# EAGLE design Arduino Sersor Board (EAGLE 7.5.0)
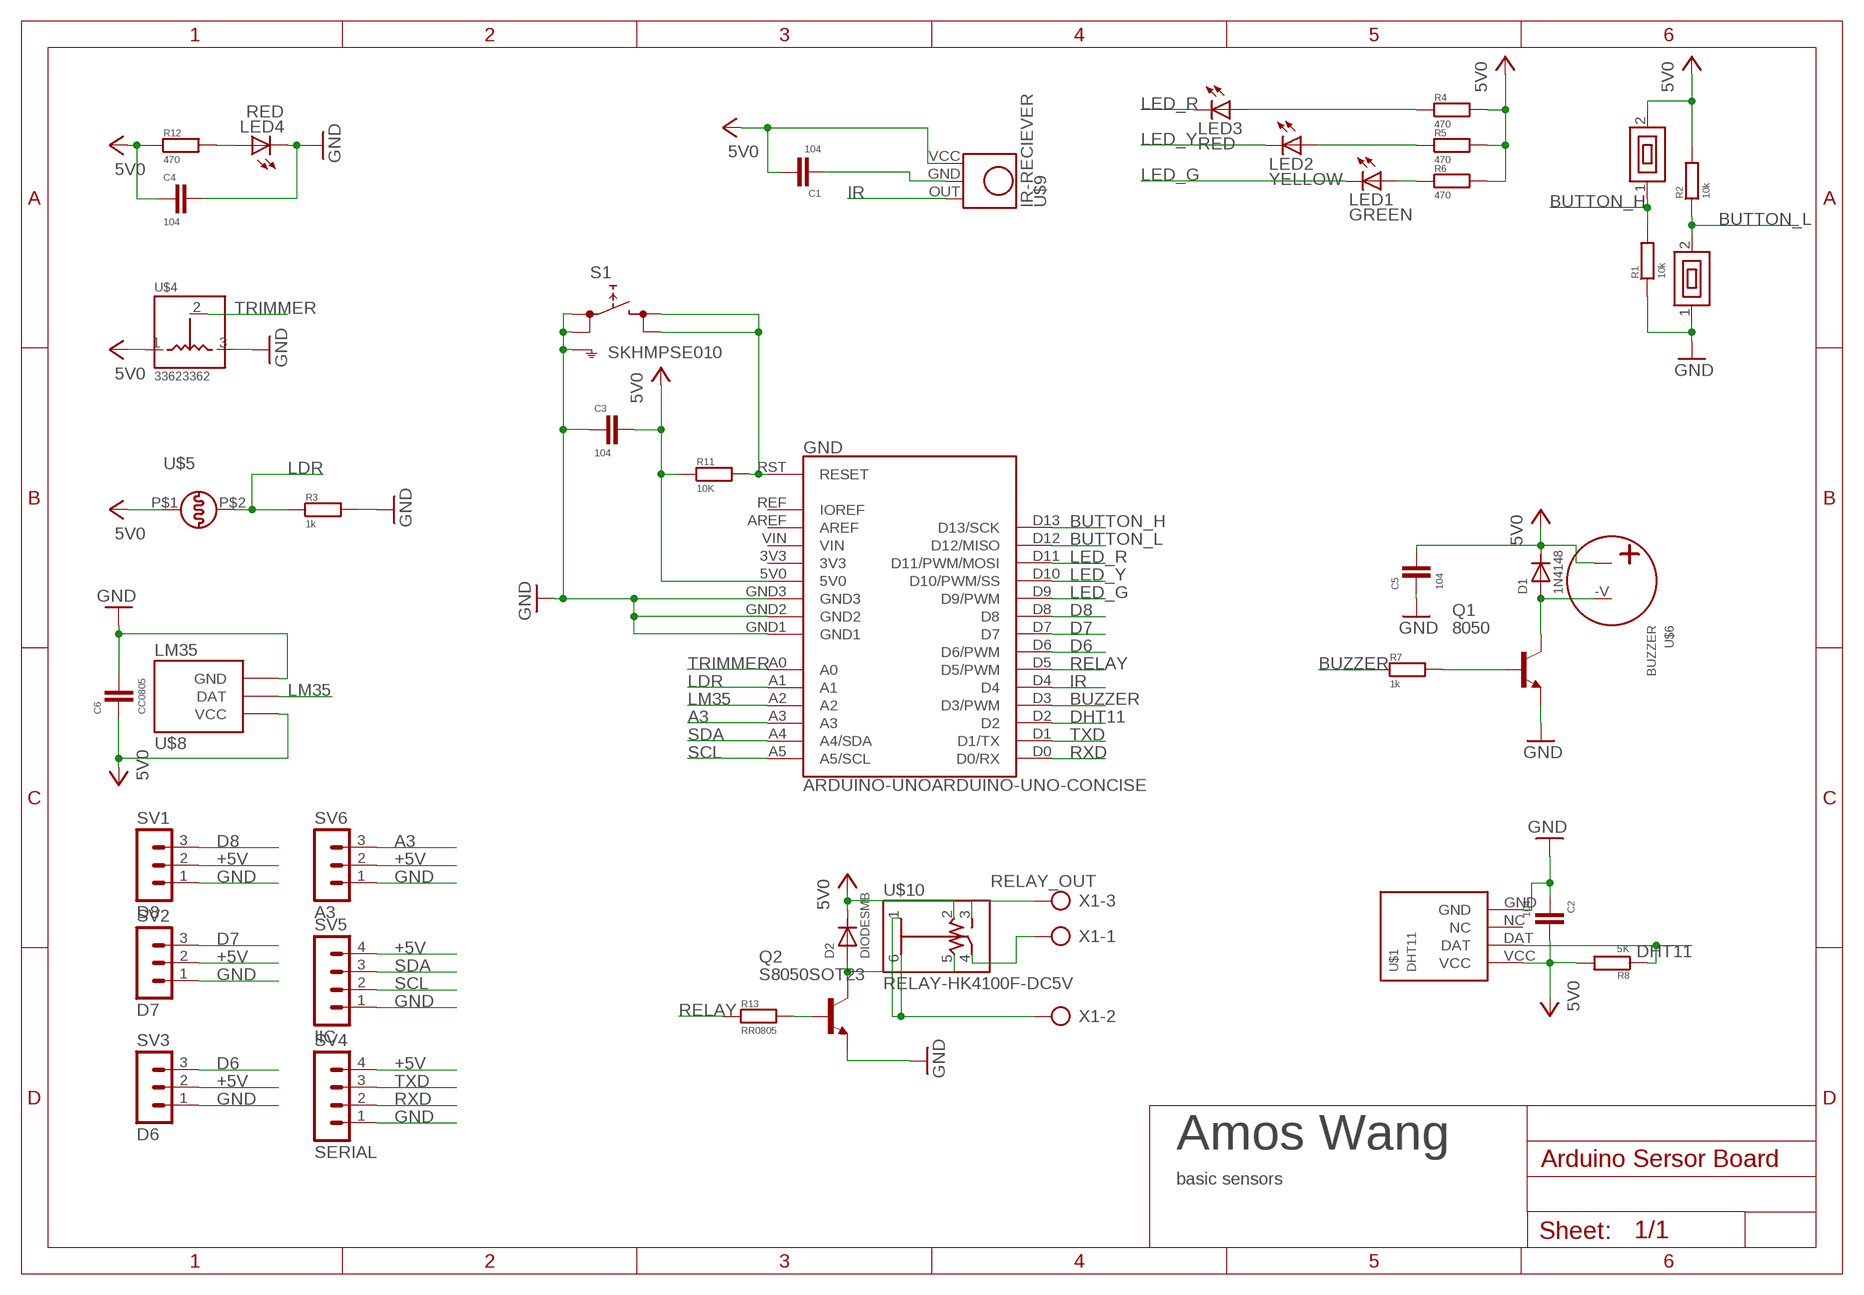
[diagram p0: schematic, sheet 1]

## Parts
C1  104  CC0805  [C0805]
C2  104  CC0805  [C0805]
C3  104  CC0805  [C0805]
C4  104  CC0805  [C0805]
C5  104  CC0805  [C0805]
C6  CC0805  [C0805]
D1  1N4148  DIODESMB  [SMB]
D2  DIODESMB  [SMB]
GND  ARDUINO-UNOARDUINO-UNO-CONCISE  [ARDUINO-UNO]
LED1  GREEN  LEDSQR2X5  [LED2X5]
LED2  YELLOW  LEDSQR2X5  [LED2X5]
LED3  RED  LEDSQR2X5  [LED2X5]
LED4  RED  LEDCHIP-LED0805  [CHIP-LED0805]
Q1  8050  S8050SOT23  [SOT23]
Q2  S8050SOT23  [SOT23]
R1  10k  RR0805  [R0805]
R2  10k  RR0805  [R0805]
R3  1k  RR0805  [R0805]
R4  470  RR0805  [R0805]
R5  470  RR0805  [R0805]
R6  470  RR0805  [R0805]
R7  1k  RR0805  [R0805]
R8  5K  RR0805  [R0805]
R11  10K  RR0805  [R0805]
R12  470  RR0805  [R0805]
R13  RR0805  [R0805]
S1  SKHMPSE010  [SKHMPXE010]
SV1  D8  MA03-1  [MA03-1]
SV2  D7  MA03-1  [MA03-1]
SV3  D6  MA03-1  [MA03-1]
SV4  SERIAL  MA04-1  [MA04-1]
SV5  IIC  MA04-1  [MA04-1]
SV6  A3  MA03-1  [MA03-1]
U$1  DHT11  [DHT11]
U$2  SMD-36SMD-3*6  [SMD-3*6]
U$3  SMD-36SMD-3*6  [SMD-3*6]
U$4  33623362  [3362]
U$5  LDR  [LDR]
U$6  BUZZER  [BUZZER]
U$8  LM35  [TO92]
U$9  IR-RECIEVER  [IR-RECIEVER]
U$10  RELAY-HK4100F-DC5V  [RELAY-HK4100F-DC5V]
X1  RELAY_OUT  AK500/3  [AK500/3]

## Nets
+5V: C1.1 C2.1 C3.1 C4.2 C5.1 C6.2 D1.1 D2.1 GND.5V0 R2.2 R4.2 R5.2 R6.2 R8.2 R11.1 R12.1 SV1.2 SV2.2 SV3.2 SV4.4 SV5.4 SV6.2 U$1.VCC U$2.2 U$4.1 U$5.P$1 U$6.+V U$8.1(VCC) U$9.VCC U$10.2 ; supply symbol labelled 5V0
A3: GND.A3 SV6.3
BUTTON_H: GND.D13(D13/SCK) R1.2 U$2.1
BUTTON_L: GND.D12(D12/MISO) R2.1 U$3.2
BUZZER: GND.D3(D3/PWM) R7.1
D6: GND.D6(D6/PWM) SV3.3
D7: GND.D7 SV2.3
D8: GND.D8 SV1.3
DHT11: GND.D2 R8.1 U$1.DAT
GND: C2.2 C3.2 C4.1 C5.2 C6.1 GND.GND1 GND.GND2 GND.GND3 LED4.C Q1.E Q2.E R1.1 R3.2 S1.1(1.1) S1.2(1.2) S1.5(SH) SV1.1 SV2.1 SV3.1 SV4.1 SV5.1 SV6.1 U$1.GND U$3.1 U$4.3 U$8.3(GND)
IR: GND.D4 U$9.OUT
LDR: GND.A1 R3.1 U$5.P$2
LED_G: GND.D9(D9/PWM) LED1.K(C)
LED_R: GND.D11(D11/PWM/MOSI) LED3.K(C)
LED_Y: GND.D10(D10/PWM/SS) LED2.K(C)
LM35: GND.A2 U$8.2(DAT)
N$1: GND.RST(RESET) R11.2 S1.3(2.1) S1.4(2.2)
N$2: LED4.A R12.2
N$3: LED3.A R4.1
N$4: LED2.A R5.1
N$5: LED1.A R6.1
N$6: Q1.B R7.2
N$7: D1.2 Q1.C U$6.-V
N$8: C1.2 U$9.GND
N$9: Q2.B R13.2
N$10: D2.2 Q2.C U$10.5
N$13: U$10.3 X1.3
N$15: U$10.4 X1.1
N$16: U$10.1 U$10.6 X1.2
RELAY: GND.D5(D5/PWM) R13.1
RXD: GND.D0(D0/RX) SV4.2
SCL: GND.A5(A5/SCL) SV5.2
SDA: GND.A4(A4/SDA) SV5.3
TRIMMER: GND.A0 U$4.2
TXD: GND.D1(D1/TX) SV4.3
Unconnected: GND.3V3 GND.AREF GND.REF(IOREF) GND.VIN U$1.NC

## Notes on the sheet
- Amos Wang
- basic sensors

## Library data of the parts
C1-C6 = RCLDA:C: CAPACITOR
D1 D2 = RCLDA:DIODE: DIODE
GND = Module:ARDUINO-UNO
LED1-LED4 = Display:LED: LED OSRAM: - CHIPLED LG R971, LG N971, LY N971, LG Q971, LY Q971, LO R971, LY R971 LH N974, LH R974 LS Q976, LO Q976, LY Q976 LO Q996 - Hyper CHIPLED LW Q18S LB Q993, LB Q99A, LB R99A - SideLED LS A670, LO A670, LY A670, LG A670, LP A670 LB A673, LV A673, LT A673, LW A673 LH A674 LY A675 LS A676, LA A676, LO A676, LY A676, LW A676 LS A679, LY A679, LG A679 - Hyper Micro SIDELED® LS Y876, LA Y876, LO Y876, LY Y876 LT Y87S - SmartLED LW L88C, LW L88S LB L89C, LB L89S, LG L890 LS L89K, LO L89K, LY L89K LS L896, LA L896, LO L896, LY L896 - TOPLED LS T670, LO T670, LY T670, LG T670, LP T670 LSG T670, LSP T670, LSY T670, LOP T670, LYG T670 LG T671, LOG T671, LSG T671 LB T673, LV T673, LT T673, LW T673 LH T674 LS T676, LA T676, LO T676, LY T676, LB T676, LH T676, LSB T676, LW T676 LB T67C, LV T67C, LT T67C, LS T67K, LO T67K, LY T67K, LW E67C LS E67B, LA E67B, LO E67B, LY E67B, LB E67C, LV E67C, LT E67C LW T67C LS T679, LY T679, LG T679 LS T770, LO T770, LY T770, LG T770, LP T770 LB T773, LV T773, LT T773, LW T773 LH T774 LS E675, LA E675, LY E675, LS T675 LS T776, LA T776, LO T776, LY T776, LB T776 LHGB T686 LT T68C, LB T68C - Hyper Mini TOPLED® LB M676 - Mini TOPLED Santana® LG M470 LS M47K, LO M47K, LY M47K Source: http://www.osram.convergy.de LUXEON: - LUMILED® LXK2-PW12-R00, LXK2-PW12-S00, LXK2-PW14-U00, LXK2-PW14-V00 LXK2-PM12-R00, LXK2-PM12-S00, LXK2-PM14-U00 LXK2-PE12-Q00, LXK2-PE12-R00, LXK2-PE12-S00, LXK2-PE14-T00, LXK2-PE14-U00 LXK2-PB12-K00, LXK2-PB12-L00, LXK2-PB12-M00, LXK2-PB14-N00, LXK2-PB14-P00, LXK2-PB14-Q00 LXK2-PR12-L00, LXK2-PR12-M00, LXK2-PR14-Q00, LXK2-PR14-R00 LXK2-PD12-Q00, LXK2-PD12-R00, LXK2-PD12-S00 LXK2-PH12-R00, LXK2-PH12-S00 LXK2-PL12-P00, LXK2-PL12-Q00, LXK2-PL12-R00 Source: www.luxeon.com KINGBRIGHT: KA-3528ASYC Source: www.kingbright.com
Q1 Q2 = RCLDA:S8050: NPN Transistor
R1-R8 R11-R13 = RCLDA:R: RESISTOR
S1 = Button:SKHMP*E010: 6.2 X 6.5mm TACT Switch (SMD) Source: http://www3.alps.co.jp/WebObjects/catalog.woa/PDF/E/Switch/Tact/SKHM/SKHM.PDF
SV1-SV3 SV6 = Pin-Header:MA03-1: PIN HEADER; OC_FARNELL: unknown; OC_NEWARK: unknown
SV4 SV5 = Pin-Header:MA04-1: PIN HEADER; OC_FARNELL: unknown; OC_NEWARK: unknown
U$1 = Senser:DHT11
U$2 U$3 = Button:SMD-3*6
U$4 = Senser:3362
U$5 = Senser:LDR
U$6 = Senser:BUZZER
U$8 = Senser:LM35
U$9 = Senser:IR-RECIEVER
U$10 = Senser:RELAY-HK4100F-DC5V
X1 = Connector:AK500/3: CONNECTOR; OC_FARNELL: unknown; OC_NEWARK: unknown

## Board
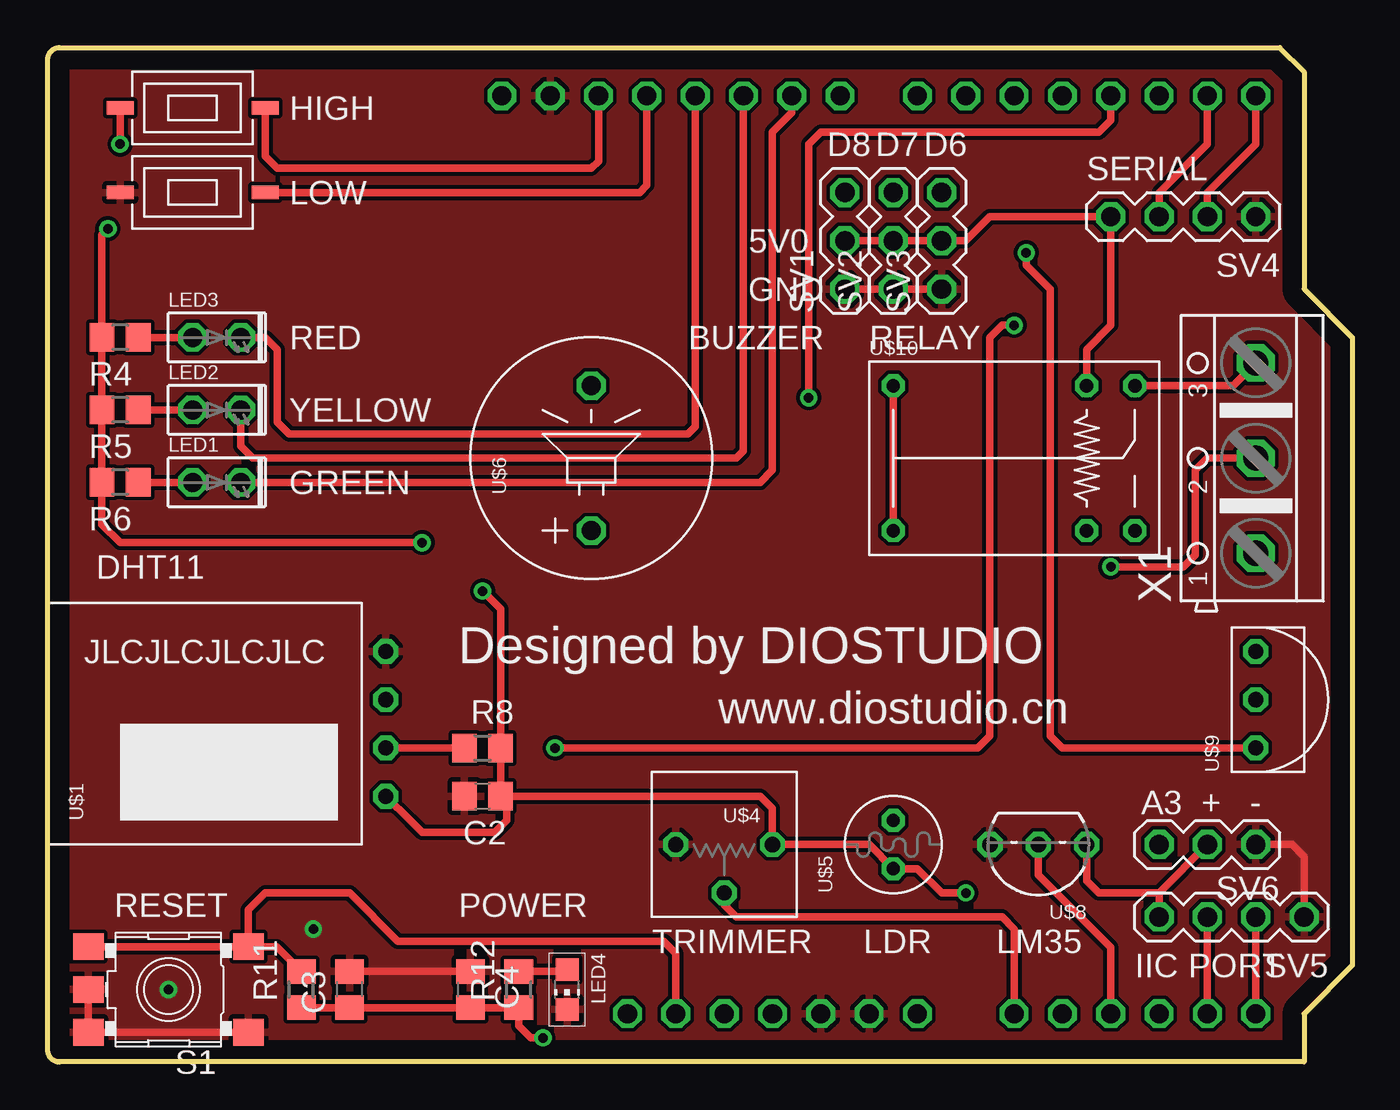
[diagram p1: board, top side]
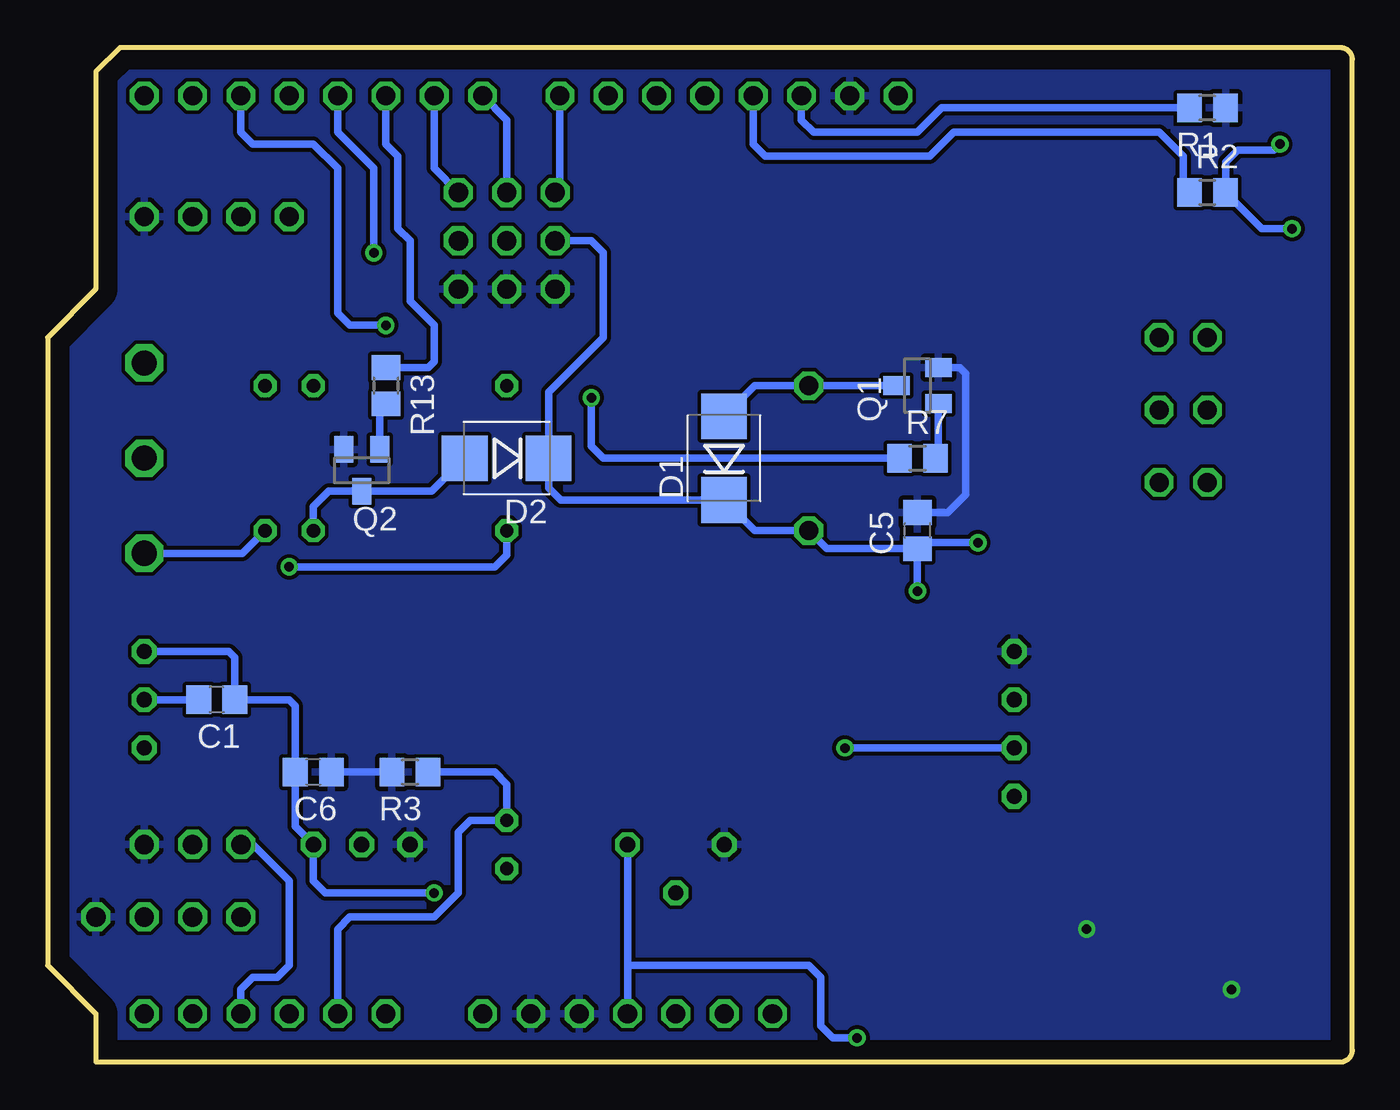
[diagram p2: board, bottom side, seen from below]

Size 68.58 x 53.34 mm. Coordinates in mm from the lower left corner, seen from the top.
Outline: 0,0.64 0,52.7 arc-90 0.64,53.34 64.77,53.34 66.04,52.07 66.04,40.64 68.58,38.1 68.58,5.08 66.04,2.54 66.04,0 0.64,0 arc-90 0,0.64
Copper layers (1*16): Top 0.035mm / dielectric 1.5mm / Bottom 0.035mm
Design rules "default": minimum track width 10mil, minimum drill 24mil, track to track 8mil, track to pad 8mil, pad to pad 8mil, via to via 8mil, smd to smd 8mil, copper to edge 40mil, drill to drill 8mil, minimum pad ring 10mil, minimum via ring 8mil, stop-mask expansion 4mil, vias tented up to drill 0mil, thermal gap 10mil

### Footprints (pad centres in the part's own frame; a part is rotated, then mirrored left to right if it is on the bottom)
C0805 = smd 1.3 x 1.5: 1 -0.95,0; 2 0.95,0
SMB = smd 2.4 x 2.4: 1 -2.2,0; 2 2.2,0
ARDUINO-UNO = drill 1 octagon: 3V3 35.56,2.54; 5V0 38.1,2.54; A0 50.8,2.54; A1 53.34,2.54; A2 55.88,2.54; A3 58.42,2.54; A4 60.96,2.54; A5 63.5,2.54; AREF 23.876,50.8; D0 63.5,50.8; D1 60.96,50.8; D2 58.42,50.8; D3 55.88,50.8; D4 53.34,50.8; D5 50.8,50.8; D6 48.26,50.8; D7 45.72,50.8; D8 41.656,50.8; D9 39.116,50.8; D10 36.576,50.8; D11 34.036,50.8; D12 31.496,50.8; D13 28.956,50.8; GND1 26.416,50.8; GND2 43.18,2.54; GND3 40.64,2.54; REF 30.48,2.54; RST 33.02,2.54; VIN 45.72,2.54
LED2X5 = drill 1 octagon: A -1.27,0; K 1.27,0
CHIP-LED0805 = smd 1.2 x 1.2: A -1.05,0; C 1.05,0
SOT23 = smd 1 x 1.4: B -0.95,-1.1; C 0,1.1; E 0.95,-1.1
R0805 = smd 1.3 x 1.5: 1 -0.95,0; 2 0.95,0
SKHMPXE010 = smd 1.6 x 1.4: 1 -4.2,2.25; 2 4.2,2.25; 3 -4.2,-2.25; 4 4.2,-2.25; 5 4.2,0
MA03-1 = drill 1.016 octagon: 1 -2.54,0; 2 0,0; 3 2.54,0
MA04-1 = drill 1.016 octagon: 1 -3.81,0; 2 -1.27,0; 3 1.27,0; 4 3.81,0
DHT11 = drill 0.8 octagon: DAT -1.27,-10.16; GND 3.81,-10.16; NC 1.27,-10.16; VCC -3.81,-10.16
SMD-3*6 = smd 1.422 x 0.711: 1 -3.81,0; 2 3.81,0
3362 = drill 0.8 octagon: 1 -2.54,0; 2 0,2.54; 3 2.54,0
LDR = drill 0.7 octagon: P$1 0,0; P$2 2.54,0
BUZZER = drill 1 octagon: +V 0,0; -V 7.62,0
TO92 = drill 0.813 octagon: 1 -2.54,0; 2 0,0; 3 2.54,0
IR-RECIEVER = drill 0.8 octagon: GND 0,0; OUT -2.54,0; VCC 2.54,0
RELAY-HK4100F-DC5V = drill 0.7 octagon: 1 -6.35,3.81; 2 3.81,3.81; 3 6.35,3.81; 4 6.35,-3.81; 5 3.81,-3.81; 6 -6.35,-3.81
AK500/3 = drill 1.321 octagon: 1 -5.004,0; 2 0,0; 3 5.004,0

### Placement (x,y rotation side)
C1  59.69,19.05 180 bottom
C2  22.86,13.97 180 top
C3  15.88,3.81 90 top
C4  22.23,3.81 270 top
C5  22.86,27.94 90 bottom
C6  54.61,15.24 180 bottom
D1  33.02,31.75 90 bottom
D2  44.45,31.75 180 bottom
GND  0,0 0 top
LED1  8.89,30.48 0 top
LED2  8.89,34.29 0 top
LED3  8.89,38.1 0 top
LED4  27.3,3.81 270 top
Q1  22.86,35.56 90 bottom
Q2  52.07,31.11 180 bottom
R1  7.62,50.16 180 bottom
R2  7.62,45.72 0 bottom
R3  49.53,15.24 180 bottom
R4  3.81,38.1 180 top
R5  3.81,34.29 180 top
R6  3.81,30.48 180 top
R7  22.86,31.75 0 bottom
R8  22.86,16.51 0 top
R11  13.34,3.81 90 top
R12  24.77,3.81 90 top
R13  50.8,35.56 270 bottom
S1  6.35,3.81 180 top
SV1  41.91,43.18 90 top
SV2  44.45,43.18 90 top
SV3  46.99,43.18 90 top
SV4  59.69,44.45 180 top
SV5  62.23,7.62 180 top
SV6  60.96,11.43 180 top
U$1  7.62,17.78 90 top
U$2  7.62,50.16 180 top
U$3  7.62,45.72 0 top
U$4  35.56,11.43 180 top
U$5  44.45,10.16 90 top
U$6  28.57,27.94 90 top
U$8  52.07,11.43 180 top
U$9  63.5,19.05 90 top
U$10  50.8,31.75 0 top
X1  63.5,31.75 90 top

### Tracks (layer width: path | path; a pad name or v marks a point on that pad's centre or on a via)
+5V  (via drill 0.5)
  Top 0.406: R11.1 C3.1 C4.2 R12.1 24.77,1.91 25.4,1.27 v26.04,1.27 | U$10.2 54.61,37.47 55.88,38.73 SV4.4 49.53,44.45 48.26,43.18 SV3.2 SV2.2 SV1.2 | v48.26,8.89 46.99,8.89 45.72,10.16 U$5.P$1 43.18,11.43 U$4.1 38.1,13.34 37.47,13.97 24.13,13.97 | v19.68,27.3 3.81,27.3 2.86,28.25 R6.2 R5.2 R4.2 2.86,43.5 v3.17,43.81 | v22.86,24.77 23.81,23.82 R8.2 C2.1 24.13,13.97 | 24.13,13.97 24.13,12.7 23.5,12.06 19.68,12.06 19.05,12.7 U$1.VCC | v3.81,48.26 U$2.2 | SV5.4 58.42,8.89 | 58.42,8.89 SV6.2 | 58.42,8.89 55.24,8.89 54.61,9.53 U$8.1
  Bottom 0.406: C5.1 27.62,26.99 U$6.+V 31.41,27.94 D1.1 41.62,29.55 42.25,30.18 D2.1 42.25,35.22 39.37,38.1 39.37,42.55 40.01,43.18 SV1.2 | v48.26,8.89 53.98,8.89 54.61,9.53 U$8.1 55.56,12.38 C6.2 55.56,18.73 55.88,19.05 C1.1 58.74,21.27 59.05,21.59 U$9.VCC | 38.1,5.08 U$4.1 | v19.68,27.3 22.55,27.3 C5.1 | v22.86,24.77 C5.1 | v3.17,43.81 4.76,43.81 R2.2 6.67,47.3 6.03,47.94 4.13,47.94 v3.81,48.26 | v26.04,1.27 27.3,1.27 27.94,1.91 27.94,4.45 28.57,5.08 38.1,5.08 | 38.1,5.08 GND.5V0
A3
  Bottom 0.406: SV6.3 57.78,11.43 55.88,9.53 55.88,5.08 56.52,4.45 57.78,4.45 58.42,3.81 GND.A3
BUTTON_H
  Top 0.406: GND.D13 28.96,47.37 28.57,46.99 12.06,46.99 11.43,47.62 U$2.1
  Bottom 0.406: R1.2 21.59,50.16 22.86,48.9 28.32,48.9 28.96,49.53 GND.D13
BUTTON_L
  Top 0.406: GND.D12 31.5,46.1 31.11,45.72 U$3.2
  Bottom 0.406: R2.1 8.89,45.72 8.89,47.62 10.16,48.9 20.95,48.9 22.23,47.62 30.86,47.62 31.5,48.26 GND.D12
BUZZER  (via drill 0.5)
  Top 0.406: GND.D3 55.88,49.53 55.24,48.9 40.64,48.9 40.01,48.26 v40.01,34.92
  Bottom 0.406: v40.01,34.92 40.01,32.38 39.37,31.75 R7.1
D6
  Bottom 0.406: GND.D6 48.26,46.99 SV3.3
D7
  Bottom 0.406: GND.D7 44.45,49.53 SV2.3
D8
  Bottom 0.406: GND.D8 41.66,45.97 SV1.3
DHT11  (via drill 0.5)
  Top 0.406: U$1.DAT R8.1 | v50.8,38.73 50.16,38.73 49.53,38.1 49.53,17.14 48.9,16.51 v26.67,16.51
  Bottom 0.406: v26.67,16.51 U$1.DAT | GND.D2 58.42,48.9 57.78,48.26 54.61,48.26 53.34,46.99 53.34,39.37 52.7,38.73 v50.8,38.73
GND  (via drill 0.5)
  Top 0.406: SV1.1 SV3.1 | SV5.1 66.04,10.79 65.41,11.43 SV6.1 | S1.5 S1.2 S1.1 | C4.1 C3.2
  Bottom 0.406: C5.2 21.27,28.89 20.32,29.84 20.32,36.2 20.64,36.51 Q1.E | C6.1 R3.2
  other vias: 13.97,6.99 6.35,3.81
  pour Top: 0,0.64 0,52.7 arc-90 0.64,53.34 64.77,53.34 66.04,52.07 66.04,40.64 68.58,38.1 68.58,5.08 66.04,2.54 66.04,0 0.64,0 arc-90
  pour Bottom: 0,0.64 0,52.7 arc-90 0.64,53.34 64.77,53.34 66.04,52.07 66.04,40.64 68.58,38.1 68.58,5.08 66.04,2.54 66.04,0 0.64,0 arc-90
IR  (via drill 0.5)
  Top 0.406: v51.44,42.55 51.44,41.91 52.7,40.64 52.7,17.14 53.34,16.51 U$9.OUT
  Bottom 0.406: GND.D4 53.34,48.9 51.44,46.99 v51.44,42.55
LDR
  Bottom 0.406: R3.1 45.09,15.24 44.45,14.61 U$5.P$2 46.35,12.7 46.99,12.06 46.99,8.89 48.26,7.62 52.7,7.62 53.34,6.99 GND.A1
LED_G
  Top 0.406: LED1.K 37.47,30.48 38.1,31.11 38.1,48.9 39.12,49.91 GND.D9
LED_R
  Top 0.406: GND.D11 34.04,33.4 33.66,33.02 12.7,33.02 12.06,33.66 12.06,37.47 11.43,38.1 LED3.K
LED_Y
  Top 0.406: GND.D10 36.58,32.13 36.2,31.75 10.79,31.75 10.16,32.38 LED2.K
LM35
  Top 0.406: GND.A2 55.88,6.03 52.07,9.84 U$8.2
N$1
  Top 0.406: S1.3 S1.4 | S1.3 12.04,6.06 R11.2 | GND.RST 33.02,5.71 32.38,6.35 18.41,6.35 15.88,8.89 11.43,8.89 10.55,8.01 S1.3
N$2
  Top 0.406: R12.2 27.2,4.76 LED4.A
N$3
  Top 0.406: LED3.A R4.1
N$4
  Top 0.406: LED2.A R5.1
N$5
  Top 0.406: LED1.A R6.1
N$6
  Bottom 0.406: Q1.B 21.76,31.9 R7.2
N$7
  Bottom 0.406: Q1.C U$6.-V 31.41,35.56 D1.2
N$8
  Bottom 0.406: C1.2 U$9.GND
N$9
  Bottom 0.406: Q2.B 51.12,34.29 R13.2
N$10
  Bottom 0.406: U$10.5 54.61,29.21 53.8,30.02 Q2.C 48.38,30.02 D2.2
N$13
  Top 0.406: U$10.3 62.31,35.56 X1.3
N$15
  Bottom 0.406: U$10.4 58.34,26.75 X1.1
N$16  (via drill 0.5)
  Top 0.406: U$10.6 U$10.1 | X1.2 60.96,31.75 60.33,31.11 60.33,26.67 59.69,26.04 v55.88,26.04
  Bottom 0.406: v55.88,26.04 45.09,26.04 44.45,26.67 U$10.6
RELAY
  Bottom 0.406: GND.D5 50.8,48.26 50.16,47.62 50.16,43.81 49.53,43.18 49.53,40.01 48.26,38.73 48.26,36.83 48.58,36.51 R13.1
RXD
  Top 0.406: GND.D0 63.5,48.26 60.96,45.72 SV4.2
SCL
  Top 0.406: GND.A5 SV5.2
SDA
  Top 0.406: SV5.3 GND.A4
TRIMMER
  Top 0.406: GND.A0 50.8,6.99 50.16,7.62 36.2,7.62 35.56,8.26 U$4.2
TXD
  Top 0.406: GND.D1 60.96,48.26 58.42,45.72 SV4.3

### Text on the board
tPlace: HIGH | D8 | D7 | D6 | SERIAL | LOW | 5V0 | GND | RED | BUZZER | RELAY | YELLOW | GREEN | DHT11 | JLCJLCJLCJLC | Designed by DIOSTUDIO | www.diostudio.cn | A3 | + | - | RESET | POWER | TRIMMER | LDR | LM35 | IIC PORT